# Altium project PowerAmp.PrjPcb
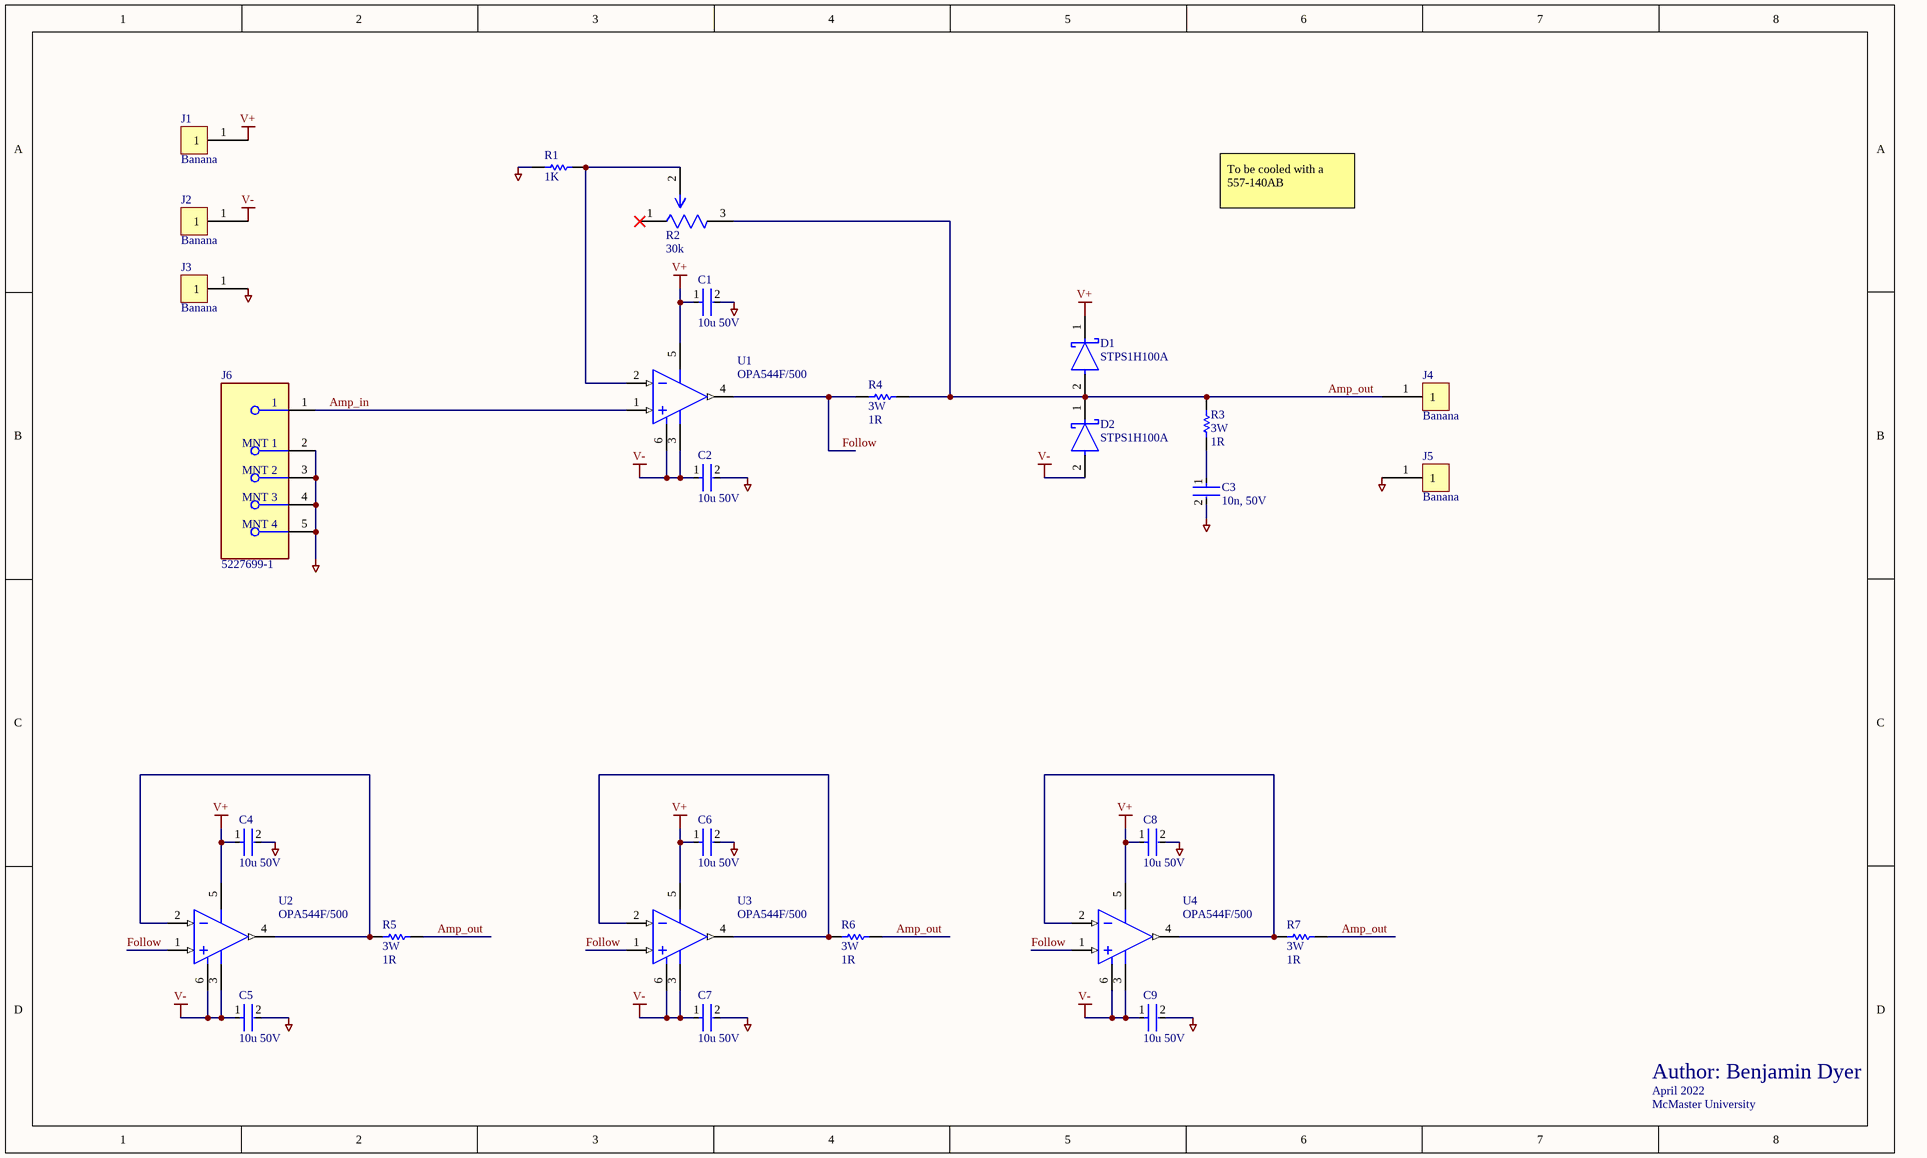
[diagram p0: Sheet1.SchDoc]
1 sheet, 28 parts. Net scope: global (net labels, ports and power ports of the same name join across sheets).
Board file: PCB1.PcbDoc

## Sheet Sheet1.SchDoc
size Legal; SheetNumber: 1; SheetTotal: 1

### Parts
C1  10u 50V  [FP-CL31-IPC_C]
C2  10u 50V  [FP-CL31-IPC_C]
C3  10n, 50V  [FP-GRM219-0_1-IPC_B]
C4  10u 50V  [FP-CL31-IPC_C]
C5  10u 50V  [FP-CL31-IPC_C]
C6  10u 50V  [FP-CL31-IPC_C]
C7  10u 50V  [FP-CL31-IPC_C]
C8  10u 50V  [FP-CL31-IPC_C]
C9  10u 50V  [FP-CL31-IPC_C]
D1  STPS1H100A  [FP-SMA-MFG]
D2  STPS1H100A  [FP-SMA-MFG]
J1  Banana  [PCBComponent_1]
J2  Banana  [PCBComponent_1]
J3  Banana  [PCBComponent_1]
J4  Banana  [PCBComponent_1]
J5  Banana  [PCBComponent_1]
J6  5227699-1  [FP-5227699-1-MFG]
R1  1K  [RESC2013X60X35ML10T20]
R2  30k  [FP-3386F-MFG]
R3  3W  value 1R  [RESC6332]
R4  3W  value 1R  [RESC6332]
R5  3W  value 1R  [RESC6332]
R6  3W  value 1R  [RESC6332]
R7  3W  value 1R  [RESC6332]
U1  OPA544F/500  [KTT0005A_L]
U2  OPA544F/500  [KTT0005A_L]
U3  OPA544F/500  [KTT0005A_L]
U4  OPA544F/500  [KTT0005A_L]

### Nets
GND: C1.2 C2.2 C3.2 C4.2 C5.2 C6.2 C7.2 C8.2 C9.2 J3.1 J5.1 J6.2(MNT_1) J6.3(MNT_2) J6.4(MNT_3) J6.5(MNT_4) R1.1
V+: C1.1 C4.1 C6.1 C8.1 D1.1(K) J1.1 U1.5(V+) U2.5(V+) U3.5(V+) U4.5(V+)
V-: C2.1 C5.1 C7.1 C9.1 D2.2(A) J2.1 U1.3(V-) U1.6(EP) U2.3(V-) U2.6(EP) U3.3(V-) U3.6(EP) U4.3(V-) U4.6(EP)
Amp_in: J6.1 U1.1(VIN+)
Amp_out: D1.2(A) D2.1(K) J4.1 R2.3(CW) R3.2 R4.2 R5.2 R6.2 R7.2
Follow: R4.1 U1.4(VO) U2.1(VIN+) U3.1(VIN+) U4.1(VIN+)
NetC3_1: C3.1 R3.1
NetR1_2: R1.2 R2.2(WIPER) U1.2(VIN-)
NetR5_1: R5.1 U2.2(VIN-) U2.4(VO)
NetR6_1: R6.1 U3.2(VIN-) U3.4(VO)
NetR7_1: R7.1 U4.2(VIN-) U4.4(VO)

Not connected (* = marked no-connect by the designer): R2 1(CCW)*

### Notes on the sheet
- To be cooled with a 557-140AB
- Author: Benjamin Dyer
- April 2022
- McMaster University

### Library data of the parts
C1 C2 C4-C9 = CMP-13271-000016-1: CAP CER 10UF 50V X5R 1206; Manufacturer: Samsung; Manufacturer Part Number: CL31A106KBHNNNE; Tolerance: 10%; Material: Ceramic; Temperature Coefficient: 15%; RoHS: TRUE; Ipc Land Pattern Name: CAPC320160X160; Temperature Range Low: -55°C; Value: 10uF; Device Class L3: Ceramic Capacitors; Category: Cap; Temperature Characteristic: X5R; Lead Free: Yes; Device Class L2: Capacitors; Octopart: https://octopart.com/cl31a106kbhnnne-samsung-19832778; ComponentLink2Description: Datasheet; Digikey Description: CAP CER 10UF 50V X5R 1206; Voltage: 50V; ComponentLink2URL: http://www.samsungsem.com/kr/support/product-search/mlcc/__icsFiles/afieldfile/2018/06/21/CL31A106KBHNNNE.pdf; Capacitance: 10uF; Temperature Range High: +85°C; Device Class L1: Passive Components; Height: 1.8mm; Automotive: No; Voltage Rating: 50V; Package: CL31; Temperature: -55°C to +85°C
C3 = CMP-2007-00135-2: Chip Multilayer Ceramic Capacitors for General Purpose, 0805, 10000pF, C0G, 30ppm/°C, 5%, 50V; Insulation Resistance: 10GR; Capacitance: 10nF; Max Operating Temperature: 125°C; Height: 0.85mm; Voltage: 50V; Dielectric Material: Ceramic; Voltage Rating: 50V; Dielectric: C0G; Thickness: 0.037inch; REACH SVHC: No SVHC; Lead Free: Lead Free; Depth: 1.25mm; Min Operating Temperature: -55°C; Package Quantity: 1; Packaging: Tape and Reel; Case Code (Imperial): 0805; Case/Package: 0805; Mount: Surface Mount; Width: 0.049inch; Case Code (Metric): 2012; Length: 2mm; Termination: SMD/SMT; Material: Ceramic; Tolerance: 5%; Temperature Coefficient: 30ppm/°C; Number of Pins: 2; Voltage Rating (DC): 50V; Radiation Hardening: No
D1 D2 = CMP-2000-07173-2: DIODE SCHOTTKY 100V 1A SMA; Manufacturer: STMicroelectronics; Standoff Height: 0.05mm; Peak Reverse Current: 4uA; Max Junction Temp: +175°C; Max Surge Forward Current: 50A; Temperature Range High: +175°C; Device Class L3: Schottky Diodes; Height: 2.65mm; Manufacturer Part Number: STPS1H100A; ComponentLink2URL: https://www.st.com/resource/en/datasheet/stps1h100.pdf; Category: Diode; RoHS: TRUE; Automotive: No; Digikey Description: DIODE SCHOTTKY 100V 1A SMA; Mouser Description: Schottky Diodes & Rectifiers 1.0 Amp 100 Volt; Device Class L2: Diodes; ComponentLink2Description: Datasheet; Forward Current: 1A; Package: SMA; Octopart: https://octopart.com/stps1h100a-stmicroelectronics-55399361; Temperature: to +175°C; Max Repetitive Reverse Voltage: 100V; Lead Free: Yes; Device Class L1: Discrete Semiconductors
J1-J5 = Component_1
J6 = CMP-03357-000003-1: CONN BNC JACK STR 50 OHM PCB; Frequency: 4GHz; Number of Positions: 1; Body Plating: Nickel; Gender: Female; PCB Mount Retention: Without; Polarity: Standard; Body Material: Zinc; Voltage Rating: 500V; Sealable: No (Without); PCB Mounting Orientation: Vertical; Impedance: 50R; Insulation Resistance: 5GR; Orientation: Straight; Package Quantity: 30; ELV: Compliant; Min Operating Temperature: -55°C; Length: 17.45mm; Termination: Solder; Connector Type: BNC; Fastening Type: Bayonet; Contact Plating: Silver; Depth: 17.45mm; Contact Material: Bronze; Max Frequency: 4GHz; Max Operating Temperature: 85°C; Radiation Hardening: No; Mount: Through Hole; Lead Free: Lead Free; Packaging: Rail/Tube
R1 = CMP-2100-03671-1: Chip Resistor, 1 KOhm, +/- 1%, 125 mW, -55 to 155 degC, 0805 (2012 Metric), RoHS, Tape and Reel; Manufacturer: Yageo; Temperature Coefficient: 100ppm/degreesC; Voltage Rating (DC): 150V; Max Power Dissipation: 125mW; Resistance: 1KOhm; Number of Pins: 2; Number of Terminations: 2; Datasheet URL: http://www.yageo.com/NewPortal/yageodocoutput?fileName=/pdf/R-Chip/PYu-RC_Group_51_RoHS_L_5.pdf; Length: 0.079inch; Package Description: 2-Pin Surface Mounted Device, Body 2 x 1.25 mm; Depth: 1.25mm; Height: 0.024inch; Military Standard: Not; Case/Package: 0805; Package Reference: 0805; RoHSCompliant: true; Lead Free: LeadFree; Packaging: TapeandReel; Package Quantity: 1; Datasheet Version: Rev. 5, 10/2016; Tolerance: 1%; Min Operating Temperature: -55degC; Voltage Rating: 150V; Composition: ThickFilm; Case Code (Imperial): 0805; Power Rating: 125mW; Width: 0.049inch; Case Code (Metric): 2012; Manufacturer URL: http://www.yageo.com/; Max Operating Temperature: 155degC; REACH SVHC: Unknown; Termination: SMD/SMT
R2 = CMP-07234-000018-1: TRIMMER 30K OHM 0.5W PC PIN TOP; Manufacturer Part Number: 3386F-1-303LF; Manufacturer: Bourns; Voltage Rating: 300V; Tolerance: 10%; Value: 30kΩ; Standoff Height: 0.38mm; Temperature Coefficient: 100ppm/°C; Category: Res; Series: 3386; Device Class L1: Passive Components; Temperature Range Low: -55°C; RoHS: TRUE; Temperature: -55°C to +125°C; Device Class L2: Resistors; ComponentLink2URL: https://www.bourns.com/docs/Product-Datasheets/3386.pdf; Mouser Description: Trimmer Resistors - Through Hole 3/8 30Kohms 10% 0.5Watts Square; Octopart: https://octopart.com/3386f-1-303lf-bourns-1032328; Digikey Description: TRIMMER 30K OHM 0.5W PC PIN TOP; Lead Free: Yes; Automotive: No; Package: 3386F; Temperature Range High: +125°C; Composition: Cermet; ComponentLink2Description: Datasheet; Power Rating: 0.5W; Height: 5.08mm; Resistance: 30kΩ; Device Class L3: Variable Resistors and Potentiometers
R3-R7 = Res1: Resistor; Published: 8-Jun-2000; LatestRevisionDate: 17-Jul-2002; LatestRevisionNote: Re-released for DXP Platform.; PackageReference: AXIAL-0.3; Publisher: Altium Limited; PackageDescription: Axial Device, Thru-Hole; 2 Leads; 0.3 in Pin Spacing; Supplier 1: Avnet; Supplier Part Number 1: RHC2512FT1R00
U1-U4 = CMP-0272-03687-3: High-Voltage, High-Current Operational Amplifier, 20 to 70 V, -40 to 85 degC, 5-pin DPAK (KTT5), Green (RoHS & no Sb/Br); Manufacturer: Texas Instruments; GBW(Typ)(MHz): 1.4; CMRR(Min)(dB): 90; Number of Channels: 1; Sub Family: High Output Current Amplifier (>=50mA), High Supply Voltage Amplifier (>=30V), Precision Amplifier; Packing: LARGE T&R; IIB(Max)(pA): 100; Rating: Catalog; Total Supply Voltage(Max)(+5V is 5, +/-5V is 10): 70; Iq per channel(Max)(mA): 15; Vio (25C)(Max)(mV): 5; Offset Drift(Typ)(uV/C): 10; Slew Rate(Typ)(V/us): 8; Total Supply Voltage(Min)(+5V is 5, +/-5V is 10): 20; PackageReference: KTT0005A; ComponentLink3Description: Package Specification; ComponentLink1URL: http://www.ti.com/; PackageDescription: 3-Pin Plastic Flange Mount, Body 10.16 x 10.34 mm, Pitch 1.7 mm; ComponentLink2Description: Datasheet; ComponentLink3URL: http://www.ti.com/litv/pdf/mpsf007e; Eco-Plan: Green (RoHS & no Sb/Br); PackageVersion: 4200577-3/F, 07/2011; Code_JEDEC: TO-263; Mounting Technology: Surface Mount; ComponentLink1Description: Manufacturer URL; PartNumber: OPA544F/500; DatasheetVersion: SBOS038; ComponentLink2URL: http://www.ti.com/lit/ds/symlink/opa544.pdf